# EAGLE design oddspi (EAGLE 6.6.0)
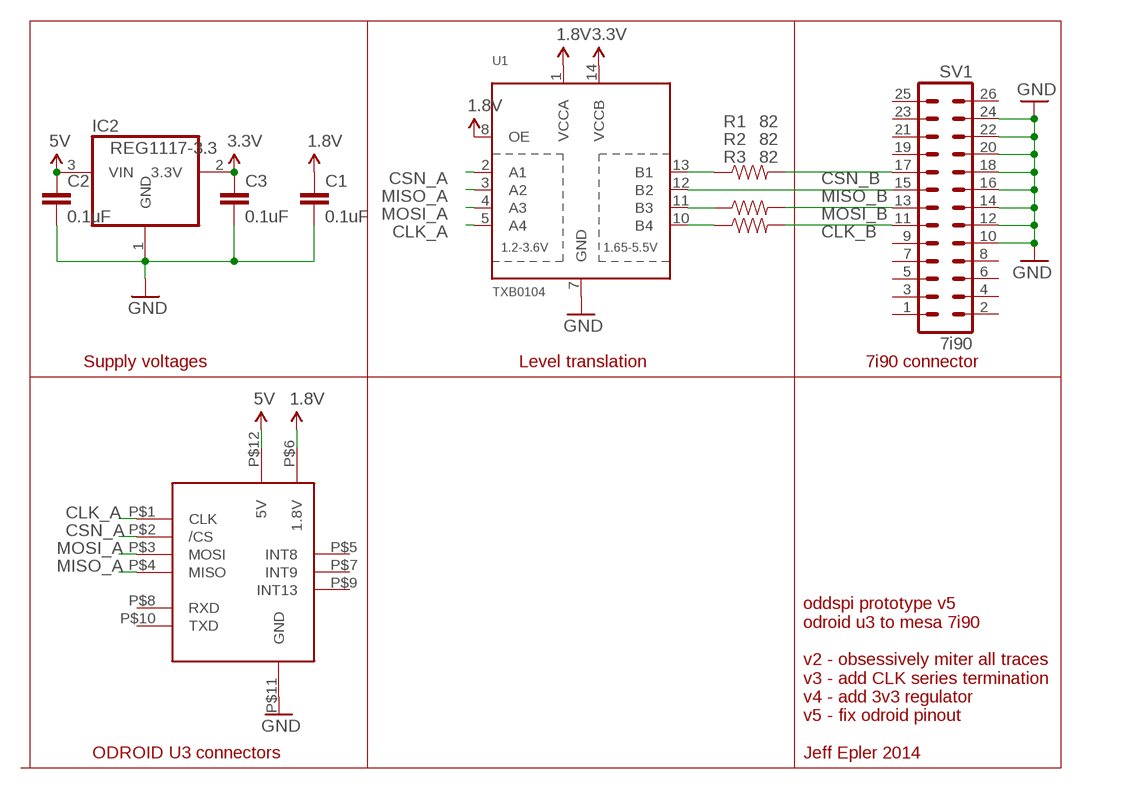
[diagram p0: schematic, sheet 1]

## Parts
C1  0.1uF  0.1UF-25V(+80/-20%)(0603)  [0603-CAP]
C2  0.1uF  0.1UF-25V(+80/-20%)(0603)  [0603-CAP]
C3  0.1uF  0.1UF-25V(+80/-20%)(0603)  [0603-CAP]
IC2  REG1117-3.3  [SOT223]
R1  82  RESISTOR0603-RES  [0603-RES]
R2  82  RESISTOR0603-RES  [0603-RES]
R3  82  RESISTOR0603-RES  [0603-RES]
SV1  7i90  ML26  [ML26]
U1  TXB0104  TXB0104PWRSOIC14  [SO14]
U$4  ODROID-U3  [U3V05]

## Nets
1.8V [pwr]: C1.1 U1.1(VCCA) U1.8(OE) U$4.P$6(1.8V)
3.3V [pwr]: C3.1 IC2.2(3.3V) U1.14(VCCB)
5V [pwr]: C2.1 IC2.3(VIN) U$4.P$12(5V)
CLK_A: U1.5(A4) U$4.P$1(CLK)
CLK_B [sig5v]: R1.2 SV1.11
CSN_A: U1.2(A1) U$4.P$2(/CS)
CSN_B [sig5v]: R3.2 SV1.17
GND: C1.2 C2.2 C3.2 IC2.1(GND) SV1.10 SV1.12 SV1.14 SV1.16 SV1.18 SV1.20 SV1.22 SV1.24 U1.7(GND) U$4.P$11(GND)
MISO_A: U1.3(A2) U$4.P$4(MISO)
MISO_B [sig5v]: SV1.15 U1.12(B2)
MOSI_A: U1.4(A3) U$4.P$3(MOSI)
MOSI_B [sig5v]: R2.2 SV1.13
N$1 [sig5v]: R1.1 U1.10(B4)
N$2 [sig5v]: R3.1 U1.13(B1)
N$3 [sig5v]: R2.1 U1.11(B3)
Unconnected: SV1.1 SV1.2 SV1.3 SV1.4 SV1.5 SV1.6 SV1.7 SV1.8 SV1.9 SV1.19 SV1.21 SV1.23 SV1.25 SV1.26 U$4.P$5(INT8) U$4.P$7(INT9) U$4.P$8(RXD) U$4.P$9(INT13) U$4.P$10(TXD)

## Notes on the sheet
- Supply voltages | Level translation | 7i90 connector
- ODROID U3 connectors
- oddspi prototype v5
  odroid u3 to mesa 7i90
  
  v2 - obsessively miter all traces
  v3 - add CLK series termination
  v4 - add 3v3 regulator
  v5 - fix odroid pinout
  
  Jeff Epler 2014

## Library data of the parts
C1-C3 = SparkFun-Capacitors:0.1UF-25V(+80/-20%)(0603): CAP-00810 Ceramic Standard decoupling cap; PROD_ID: CAP-00810
IC2 = odroid-u3:REG1117-3.3: 800mA and 1A Low Dropout (LDO) Positive Regulator 1.8V, 2.5V, 2.85V, 3.3V, 5V, and Adj; MPN: REG1117; OC_FARNELL: 1097566; OC_NEWARK: 14P6981
R1-R3 = SparkFun:RESISTOR: Resistor Basic schematic elements and footprints for 0603, 1206, and PTH resistors.
SV1 = con-harting-ml:ML26: HARTING; OC_FARNELL: unknown; OC_NEWARK: unknown
U1 = odroid-u3:TXB0104PWR: 4-Bit Bi-Directional Level Shifter 1.2V-3.6V (VCCA) to 1.65V-5.5V (VCCB) bi-directional level shifter with auto direction sensing. Max data rate - VCCA 1.8V: 20Mbps (50ns), VCCA 3.3V: 100Mbps (10ns) Digikey: 296-21929-1-ND (TSSOP) IC-11329; PROD_ID: IC-11329
U$4 = odroid-u3:ODROID-U3

## Net classes
0 default: width 0.305 mm
1 sig5v: width 0.61 mm
2 pwr: width 0.61 mm

## Board
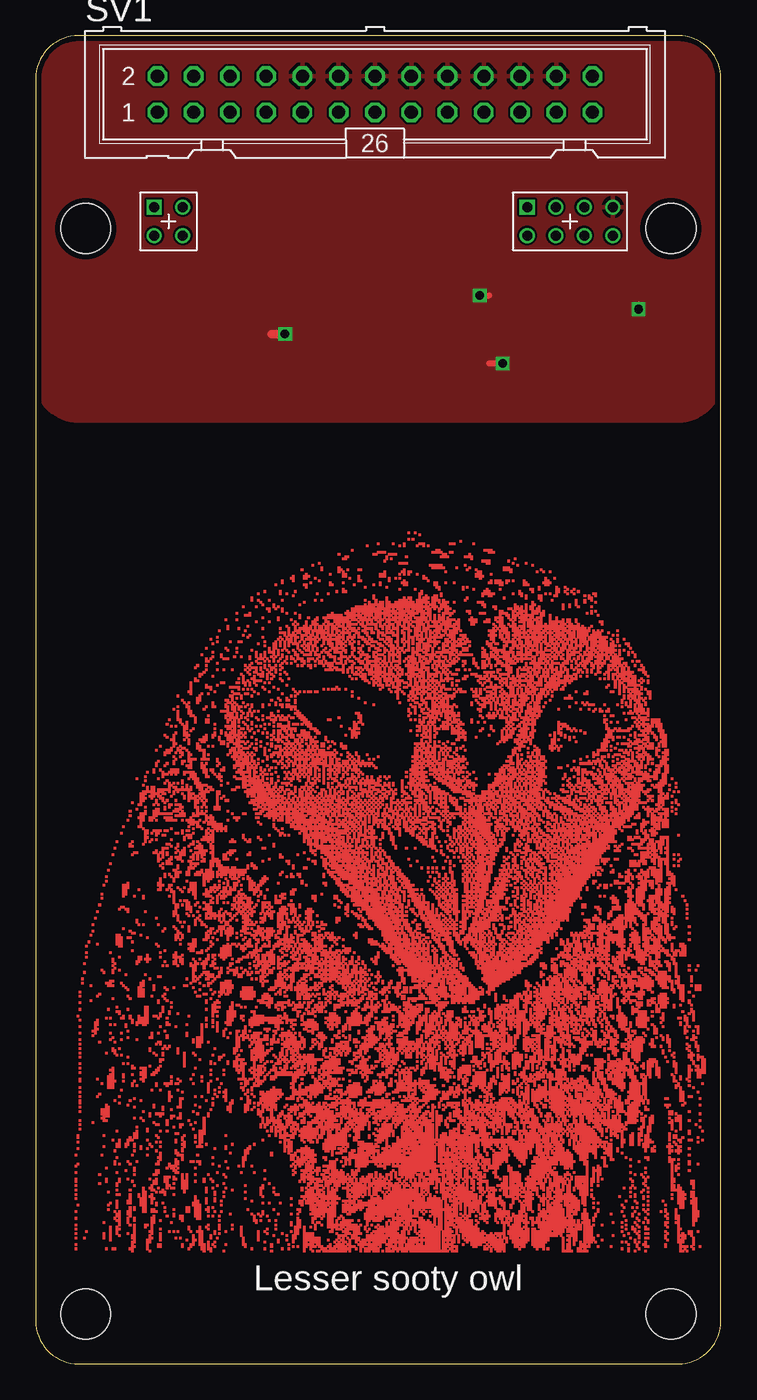
[diagram p1: board, top side]
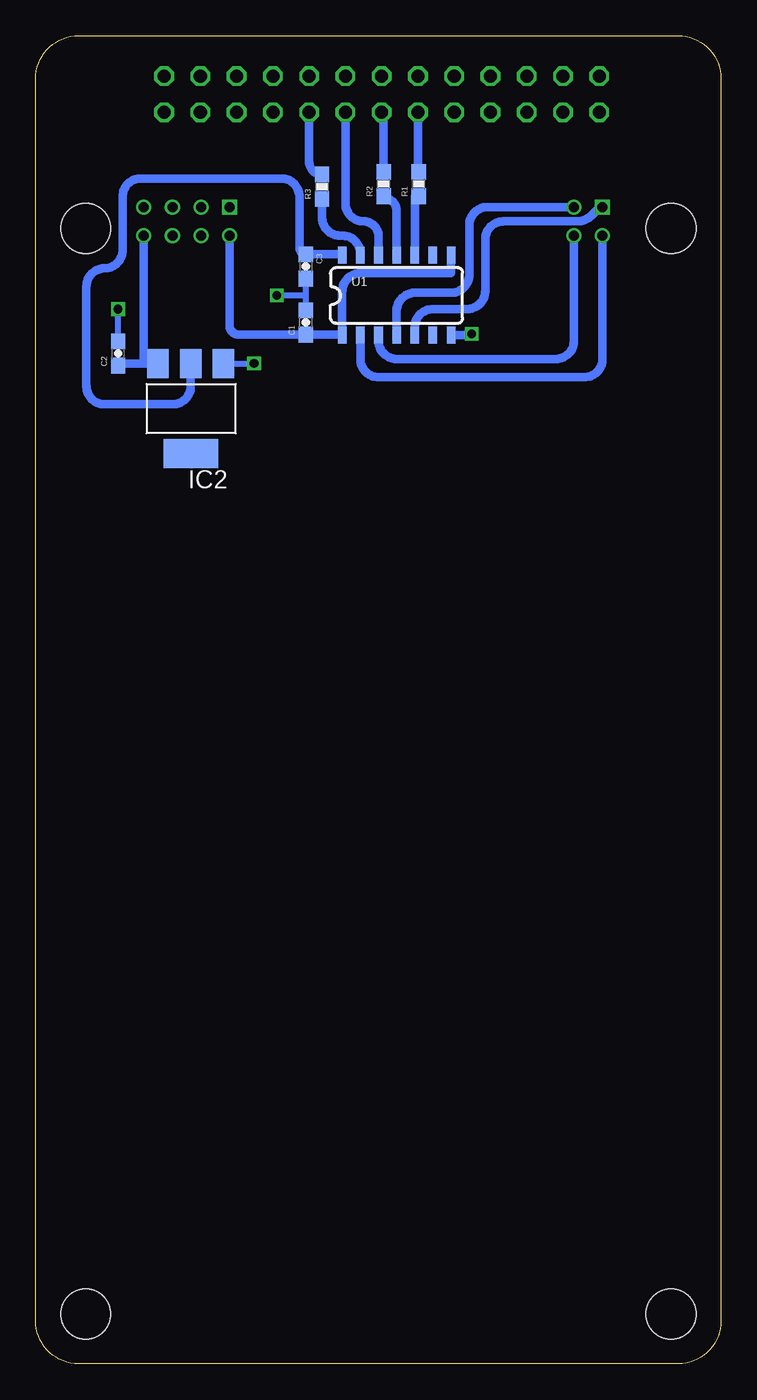
[diagram p2: board, bottom side, seen from below]

Size 48 x 93 mm. Coordinates in mm from the lower left corner, seen from the top.
Outline: 45,93 3,93 arc90 0,90 0,3 arc90 3,0 45,0 arc90 48,3 48,90 arc90 45,93
Copper layers (1*16): Top 0.0356mm / dielectric 1.5011mm / Bottom 0.0356mm
Design rules "LaenPCBOrder *": minimum track width 6mil, minimum drill 13mil, track to track 6mil, track to pad 6mil, pad to pad 6mil, via to via 6mil, smd to smd 6mil, copper to edge 15mil, drill to drill 6mil, minimum pad ring 7mil, minimum via ring 7mil, stop-mask expansion 3mil, vias tented up to drill 0mil, thermal gap 10mil

### Footprints (pad centres in the part's own frame; a part is rotated, then mirrored left to right if it is on the bottom)
0603-CAP = smd 1.1 x 1: 1 -0.85,0; 2 0.85,0
SOT223 = smd 1.499 x 2.007: 1 -2.261,-3.15; 2 0.025,-3.15; 3 2.311,-3.15 | smd 3.81 x 2.007: 4 0,3.15
0603-RES = smd 1.1 x 1: 1 -0.85,0; 2 0.85,0
ML26 = drill 0.914 octagon: 1 -15.24,-1.27; 2 -15.24,1.27; 3 -12.7,-1.27; 4 -12.7,1.27; 5 -10.16,-1.27; 6 -10.16,1.27; 7 -7.62,-1.27; 8 -7.62,1.27; 9 -5.08,-1.27; 10 -5.08,1.27; 11 -2.54,-1.27; 12 -2.54,1.27; 13 0,-1.27; 14 0,1.27; 15 2.54,-1.27; 16 2.54,1.27; 17 5.08,-1.27; 18 5.08,1.27; 19 7.62,-1.27; 20 7.62,1.27; 21 10.16,-1.27; 22 10.16,1.27; 23 12.7,-1.27; 24 12.7,1.27; 25 15.24,-1.27; 26 15.24,1.27
SO14 = smd 0.6 x 1.2: 1 -3.81,-2.8; 2 -2.54,-2.8; 3 -1.27,-2.8; 4 0,-2.8; 5 1.27,-2.8; 6 2.54,-2.8; 7 3.81,-2.8; 8 3.81,2.8; 9 2.54,2.8; 10 1.27,2.8; 11 0,2.8; 12 -1.27,2.8; 13 -2.54,2.8; 14 -3.81,2.8
U3V05 = drill 0.7 square: P$1 2,8.3; P$5 2,34.425 | drill 0.7: P$2 4,8.3; P$3 2,10.3; P$4 4,10.3; P$6 4,34.425; P$7 2,36.425; P$8 4,36.425; P$9 2,38.425; P$10 4,38.425; P$11 2,40.425; P$12 4,40.425 | hole 3.5: 79.5,3.5; 79.5,44.5; 3.5,3.5; 3.5,44.5

### Placement (x,y rotation side)
C1  29.08,72.92 90 bottom
C2  42.22,70.74 90 bottom
C3  29.08,76.84 270 bottom
IC2  37.12,66.89 180 bottom
R1  21.17,82.61 90 bottom
R2  23.63,82.61 90 bottom
R3  27.94,82.43 90 bottom
SV1  23.77,88.9 0 top
U1  22.72,74.83 0 bottom
U$4  0,83 270 top

### Tracks (layer width: path | path; a pad name or v marks a point on that pad's centre or on a via)
1.8V
  Bottom 0.61: 18.91,76.37 25.26,76.37 arc-90 26.53,75.1 U1.1 26.53,72.07 C1.1 33.79,72.07 arc90 34.42,72.7 U$4.P$6 | 18.9,77.63 U1.8 18.91,76.37 | 18.91,76.37 18.9,76.37
3.3V
  Bottom 0.61: U1.14 26.53,77.69 C3.1 arc90 29.53,78.14 29.53,81.73 arc-90 30.8,83 40.64,83 arc-90 41.91,81.73 41.91,77.98 arc90 43.18,76.71 arc-90 44.45,75.44 44.45,68.46 arc-90 43.18,67.19 38.41,67.19 arc-90 37.14,68.46 IC2.2 37.41,70.06
5V
  Bottom 0.61: U$4.P$12 40.42,70.04 | 40.42,70.04 IC2.3 | C2.1 42.22,70.04 40.42,70.04
CLK_A
  Bottom 0.61: U1.5 21.45,72.59 arc90 20.18,73.86 17.78,73.86 arc-90 16.51,75.12 16.51,78.73 arc90 15.24,80 10.03,80 arc-45 9.13,80.37 8.5,81 U$4.P$1
CLK_B
  Bottom 0.61: SV1.11 21.23,83.46 R1.2
CSN_A
  Bottom 0.61: U1.2 25.26,70.36 arc-90 23.98,69.09 9.57,69.09 arc-90 8.3,70.36 U$4.P$2
CSN_B
  Bottom 0.61: SV1.17 28.84,84.18 arc-90 R3.2
GND  (via drill 0.6)
  Top 0.406: v42.23,73.86 42.23,74.17 | v32.7,70.05 31.75,70.05 | v31.11,74.81 31.75,74.81
  Top 0.61: v17.46,72.11 16.51,72.11
  Bottom 0.406: C2.2 v42.22,73.86 v42.23,73.86 | IC2.1 v32.7,70.05 | C3.2 C1.2 29.08,74.81 v31.11,74.81
  Bottom 0.61: U1.7 17.46,72.03 v17.46,72.11
  pour Top: 48,69.04 48,90 arc90 45,93 3,93 arc90 0,90 0,69.04 arc90 3,66.04 45,66.04 arc90
MISO_A
  Bottom 0.61: U$4.P$4 10.3,71.63 arc90 11.57,70.36 22.71,70.36 arc90 23.98,71.63 U1.3
MISO_B
  Bottom 0.61: SV1.15 26.3,81.27 arc-90 25.04,80 arc90 23.98,78.95 U1.12
MOSI_A
  Bottom 0.61: U$4.P$3 16.36,81 arc-90 17.63,79.73 17.63,76.27 arc90 18.9,75 21.45,75 arc-90 22.71,73.73 U1.4
MOSI_B
  Bottom 0.61: R2.2 23.63,87.63 SV1.13
N$1
  Bottom 0.61: U1.10 21.45,81.76 R1.1
N$2
  Bottom 0.61: U1.13 25.26,77.73 arc-90 26.53,79 26.67,79 arc90 27.94,80.27 R3.1
N$3
  Bottom 0.61: U1.11 22.71,80.72 arc-90 23.63,81.64 R2.1
(copper drawn outside any net)
  shapes: Top area x31022

### Text on the board
tNames: Lesser sooty owl